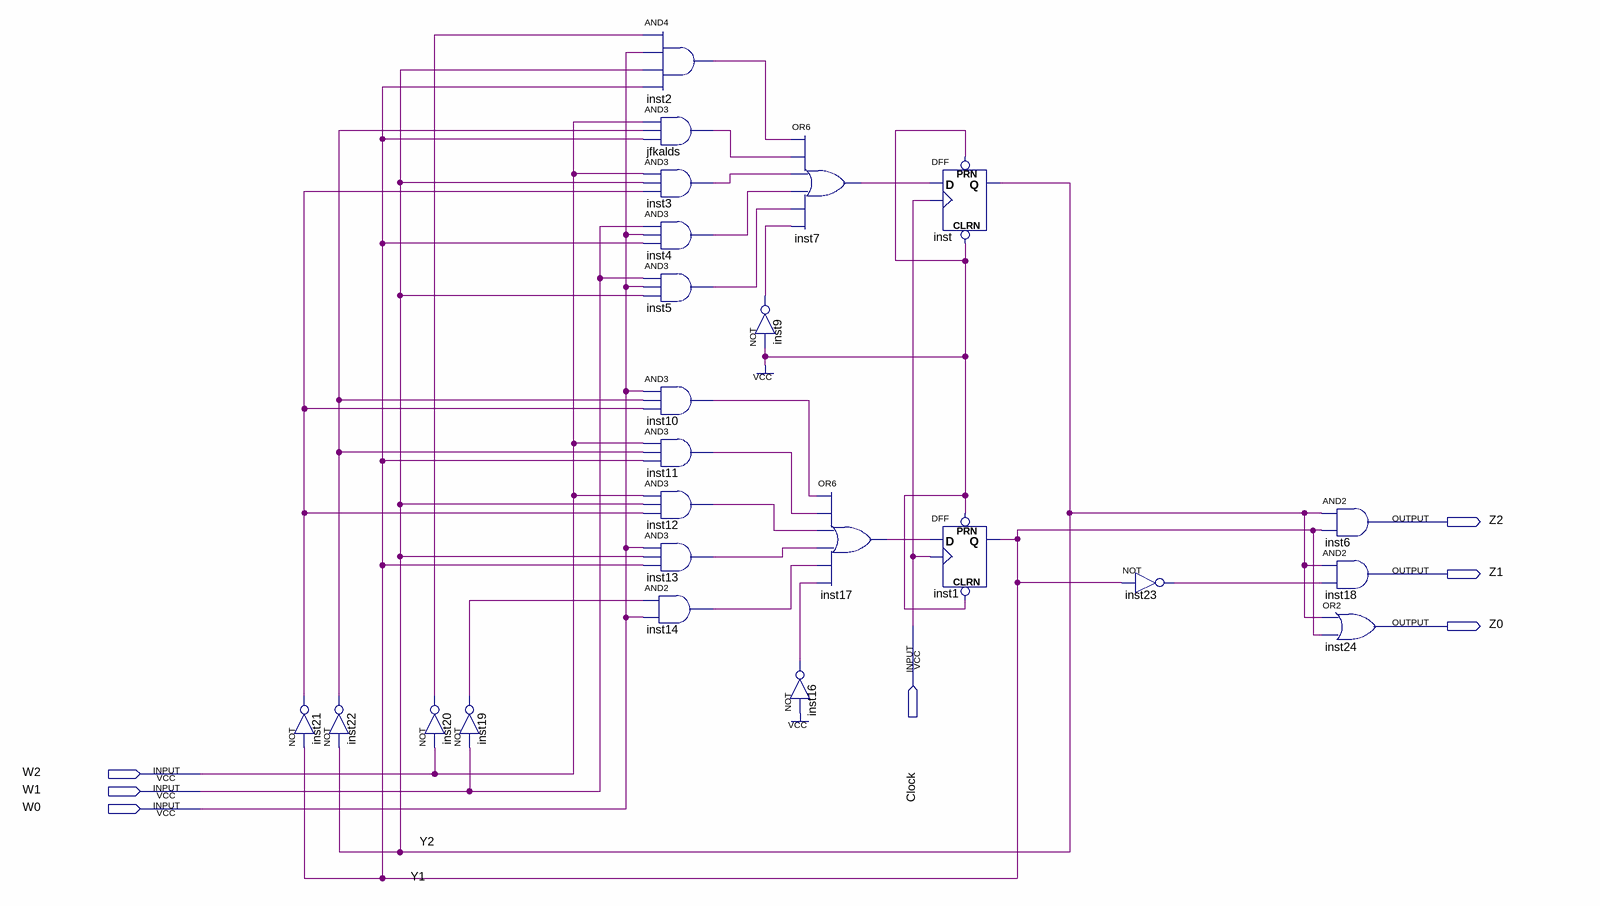
[diagram p0: schematic sheet]
// Quartus schematic StateMachine.bdf as structural Verilog: 24 symbols, 7 pins
module StateMachine (
  input  Clock,
  input  W2,
  input  W1,
  input  W0,
  output Z2,
  output Z1,
  output Z0
);

  wire inst2_out, inst3_out, inst4_out, inst5_out, inst7_out, inst9_out, inst10_out, inst11_out, inst12_out,
       inst13_out, inst14_out, inst16_out, inst17_out, inst19_out, inst20_out, inst21_out, inst22_out,
       inst23_out, jfkalds_out, Y1, Y2;

  not inst21 (inst21_out, Y1);
  not inst22 (inst22_out, Y2);
  not inst20 (inst20_out, W2);
  not inst19 (inst19_out, W1);
  and inst2 (inst2_out, inst20_out, W0, Y2, Y1);
  and jfkalds (jfkalds_out, W2, inst22_out, Y1);
  and inst3 (inst3_out, W2, Y2, inst21_out);
  and inst4 (inst4_out, W1, W0, Y1);
  and inst5 (inst5_out, W1, W0, Y2);
  and inst10 (inst10_out, W0, inst22_out, inst21_out);
  and inst11 (inst11_out, W2, inst22_out, Y1);
  and inst12 (inst12_out, W2, Y2, inst21_out);
  and inst13 (inst13_out, W0, Y2, Y1);
  and inst14 (inst14_out, inst19_out, W0);
  not inst9 (inst9_out, 1'b1);
  or inst7 (inst7_out, inst2_out, jfkalds_out, inst3_out, inst4_out, inst5_out, inst9_out);
  or inst17 (inst17_out, inst10_out, inst11_out, inst12_out, inst13_out, inst14_out, inst16_out);
  not inst16 (inst16_out, 1'b1);
  DFF inst (.CLRN(1'b1), .CLK(Clock), .D(inst7_out), .PRN(1'b1), .Q(Y2));
  DFF inst1 (.CLRN(1'b1), .CLK(Clock), .D(inst17_out), .PRN(1'b1), .Q(Y1));
  not inst23 (inst23_out, Y1);
  and inst6 (Z2, Y2, Y1);
  and inst18 (Z1, Y2, inst23_out);
  or inst24 (Z0, Y2, Y1);
endmodule
